# Altium project NODE_2.PrjPcb
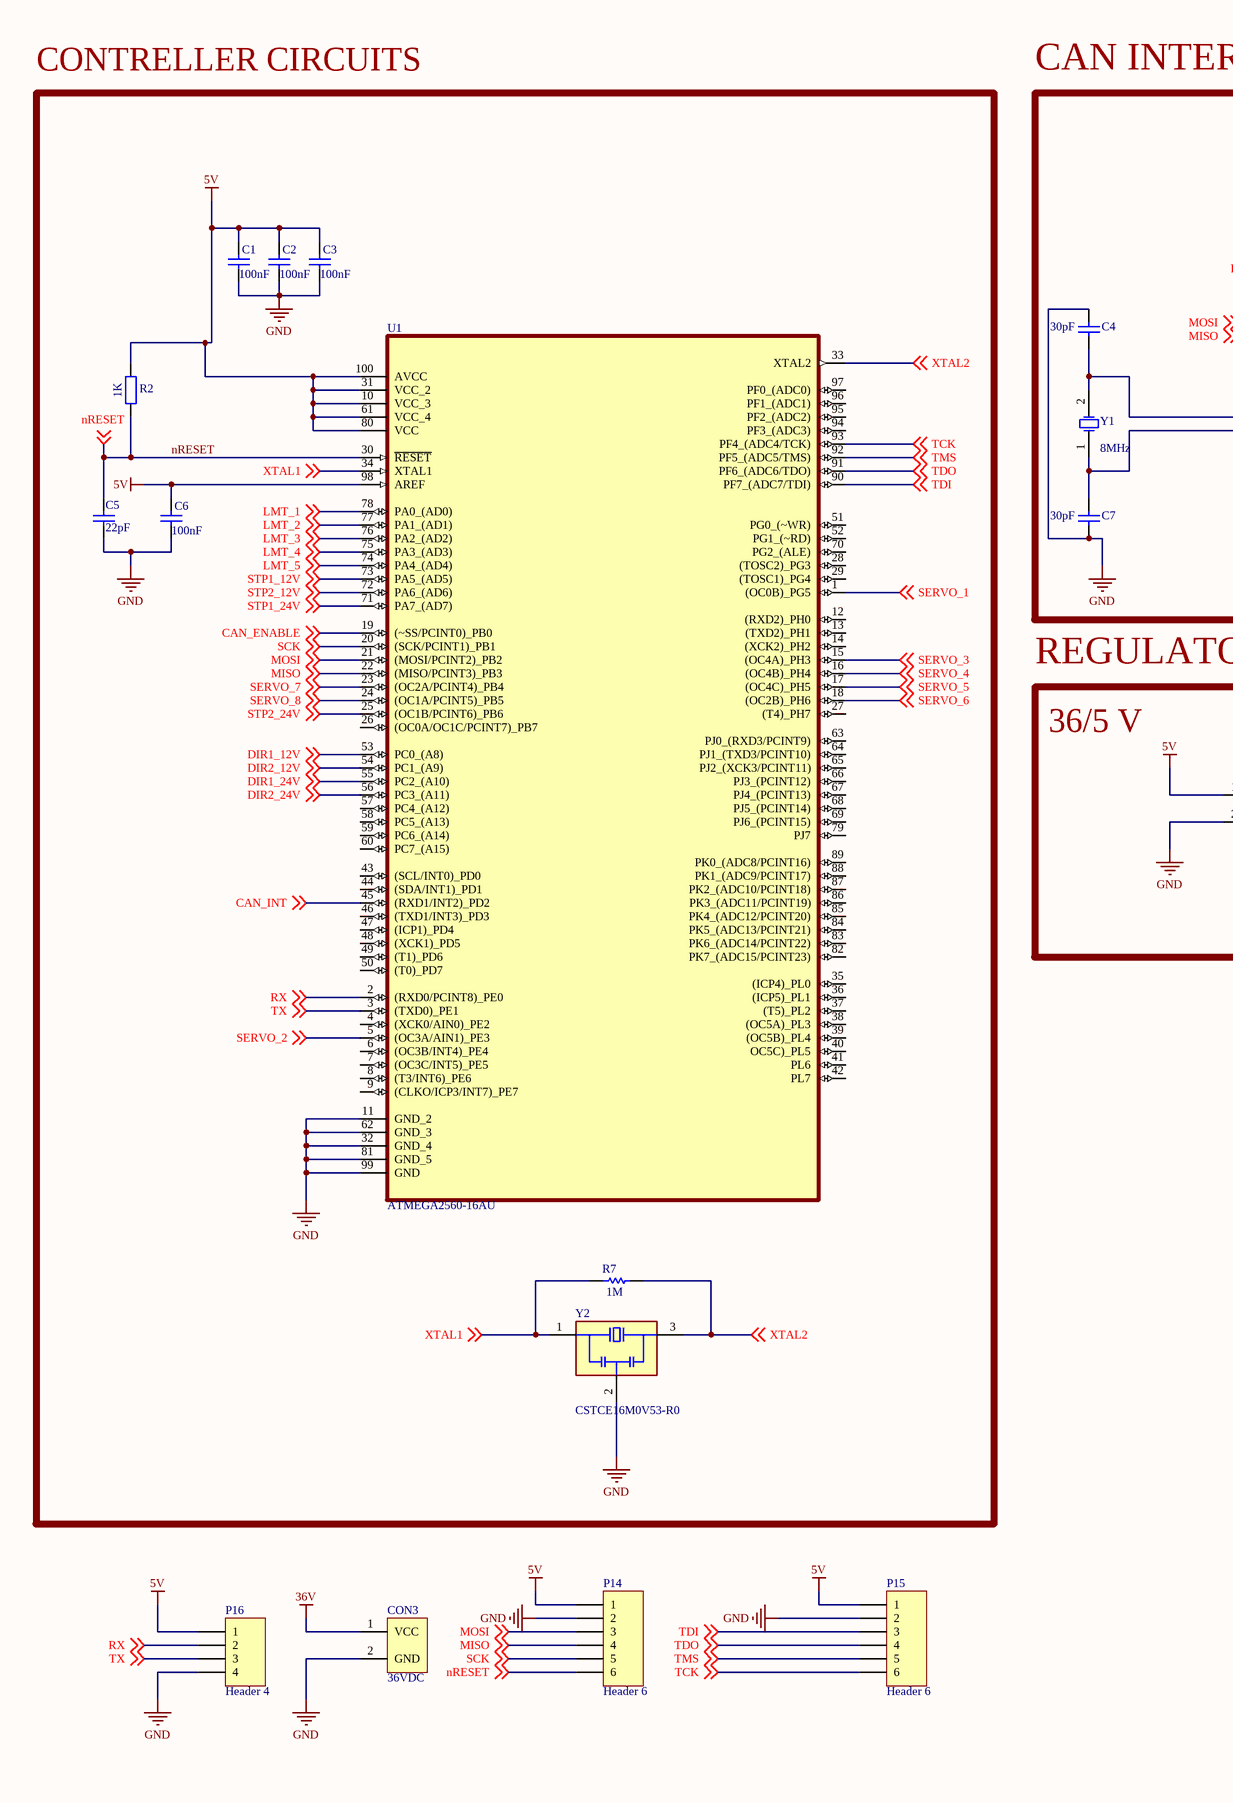
[diagram p0: NODE_2_SCH.SchDoc, left]
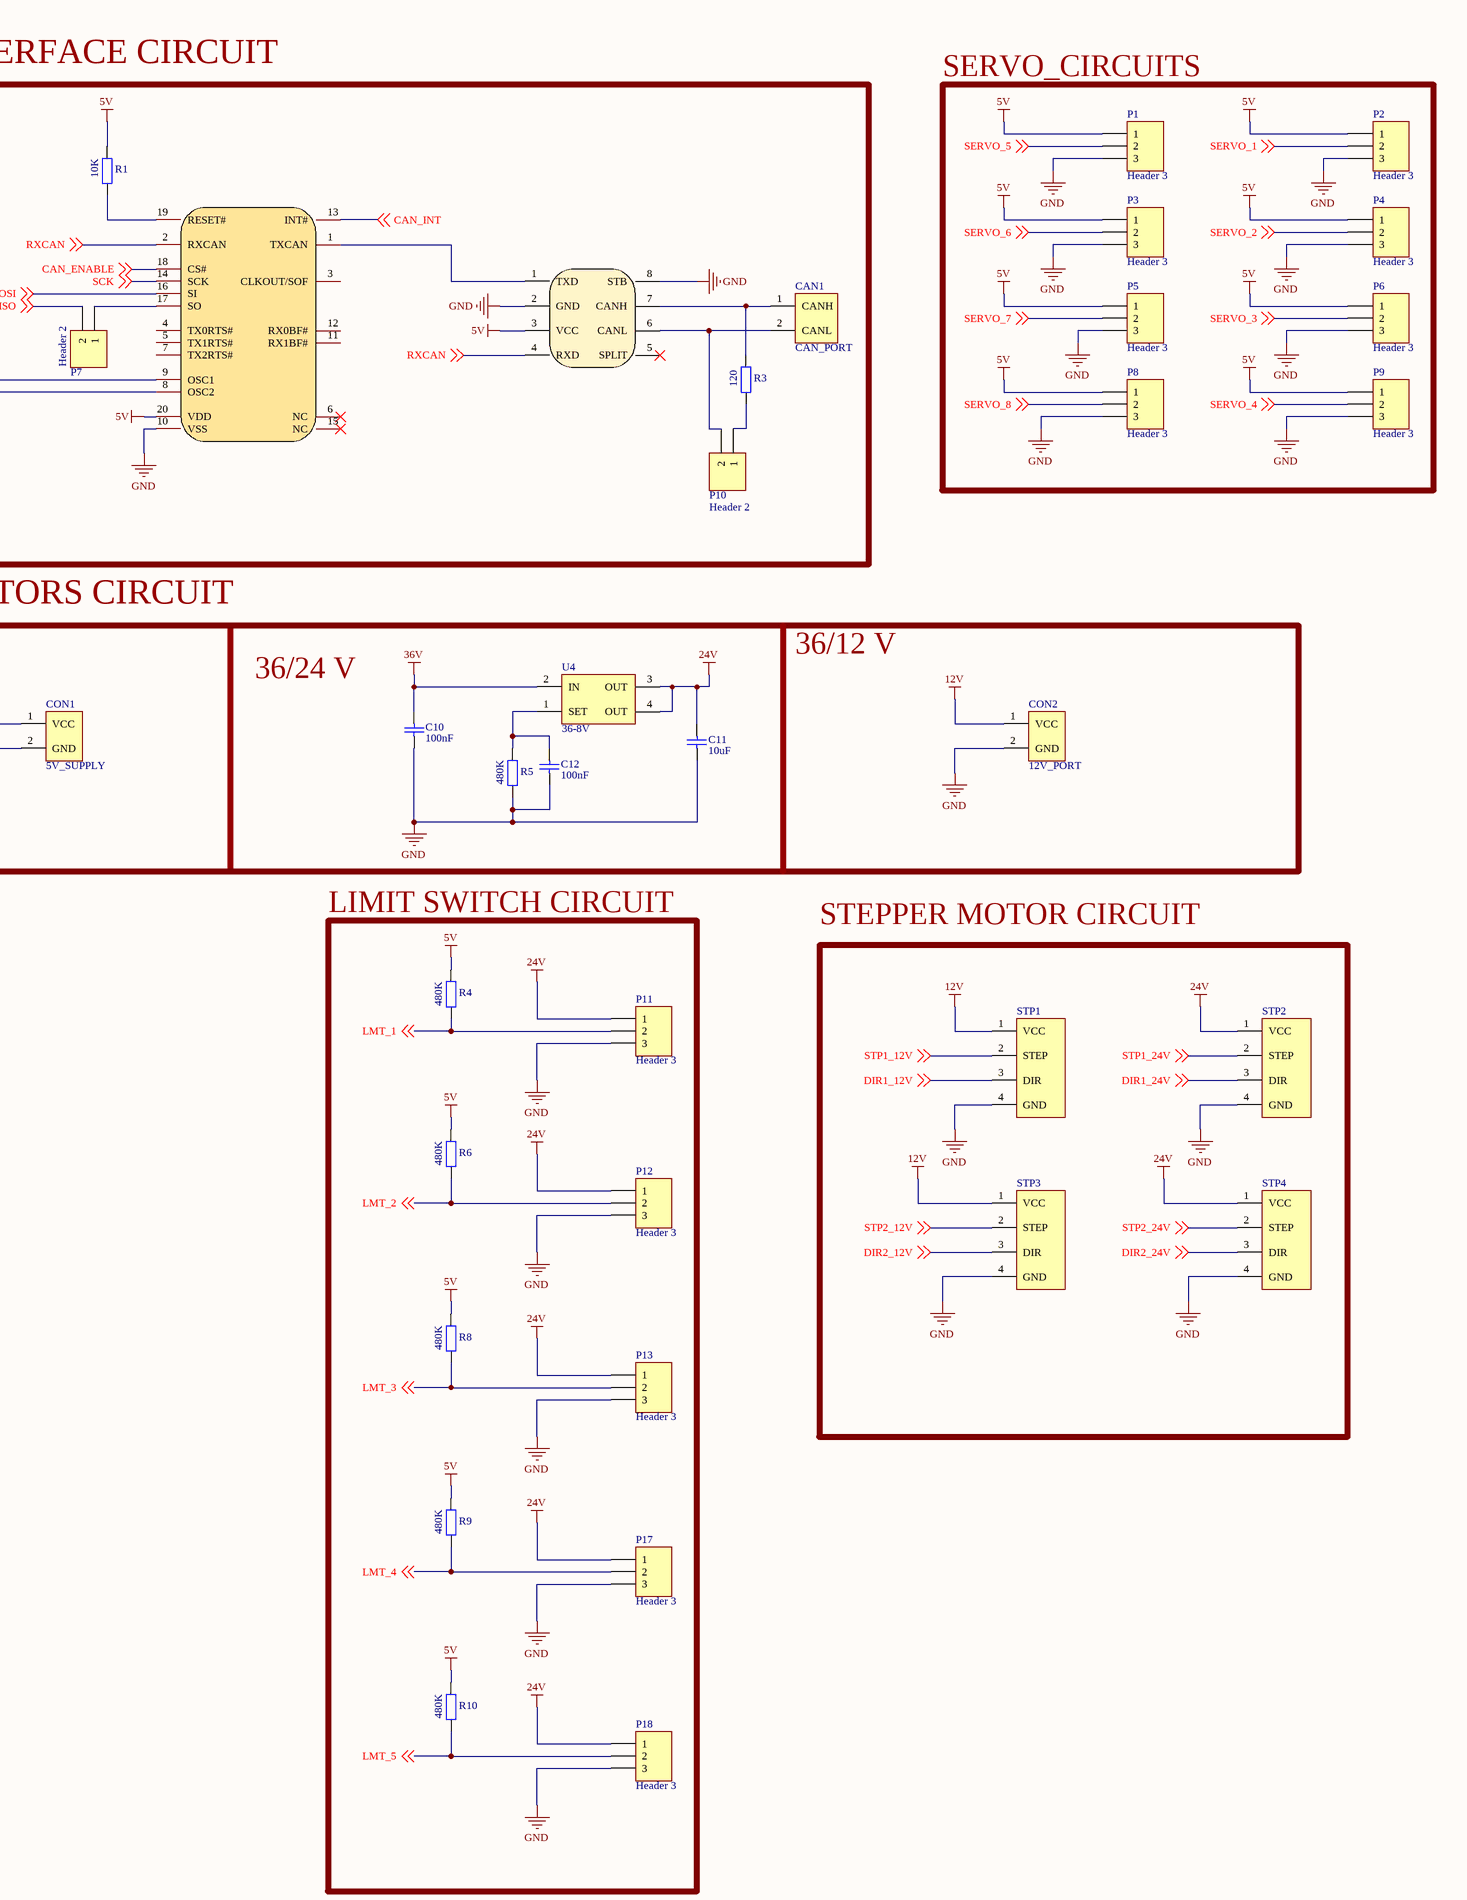
[diagram p1: NODE_2_SCH.SchDoc, right]
1 sheet, 52 parts. Net scope: global (net labels, ports and power ports of the same name join across sheets).
Board file: NODE_2_PCB.PcbDoc

## Sheet NODE_2_SCH.SchDoc
size A2; SheetNumber: 1; SheetTotal: 1; SPICEModelCacheEQZNOBOB: <root> / <DocumentId>EQZNOBOB</DocumentId> / <CacheFrame Number="0"> / <Model Name="xtal" Kind="CKT"> / <Text>*Generic type:crystal pkg:HC33/51 / .SUBCKT XTAL 1 2 PARAMS: FREQ=1Meg RS=750 C=13pf Q=1000 / LX 1 3 {((Q*RS)/(6.2831852*FREQ))} IC=0.5M / CX 3 4 {(1/(Q*6.2831852*FREQ*RS))} / C0 1 2 {C} / RS 4 2 {RS} / .ENDS XTAL</Text> / </Model> / </CacheFrame> / </root>

### Parts
C1  value 100nF  [CAPC2012X135N]  (hidden comment: Cap)
C2  value 100nF  [CAPC2012X135N]  (hidden comment: Cap)
C3  value 100nF  [CAPC2012X135N]  (hidden comment: Cap)
C4  value 30pF  [CAPC2012X135N]  (hidden comment: Cap)
C5  value 22pF  [CAPC2012X135N]  (hidden comment: Cap)
C6  value 100nF  [CAPC2012X135N]  (hidden comment: Cap)
C7  value 30pF  [CAPC2012X135N]  (hidden comment: Cap)
C10  value 100nF  [CAPC2012X135N]  (hidden comment: Cap)
C11  value 10uF  [CAPC2012X135N]  (hidden comment: Cap)
C12  value 100nF  [CAPC2012X135N]  (hidden comment: Cap)
CAN1  CAN_PORT  [12V_CON]
CON1  5V_SUPPLY  [12V_CON]
CON2  12V_PORT  [12V_CON]
CON3  36VDC  [12V_CON]
P1  Header 3  [3PIN_H]
P2  Header 3  [3PIN_H]
P3  Header 3  [3PIN_H]
P4  Header 3  [3PIN_H]
P5  Header 3  [3PIN_H]
P6  Header 3  [3PIN_H]
P7  Header 2  [SAMTEC_TS-102-G-A]
P8  Header 3  [3PIN_H]
P9  Header 3  [3PIN_H]
P10  Header 2  [SAMTEC_TS-102-G-A]
P11  Header 3  [3PIN_H]
P12  Header 3  [3PIN_H]
P13  Header 3  [3PIN_H]
P14  Header 6  [HDR1X6]
P15  Header 6  [HDR1X6]
P16  Header 4  [HDR1X4]
P17  Header 3  [3PIN_H]
P18  Header 3  [3PIN_H]
R1  value 10K  [RESC2013X06N]  (hidden comment: Res2)
R2  value 1K  [RESC2013X06N]  (hidden comment: Res2)
R3  value 120  [CRCW1206120RFKEAHP]  (hidden comment: Res2)
R4  value 480K  [CRCW1206120RFKEAHP]  (hidden comment: Res2)
R5  value 480K  [CRCW1206120RFKEAHP]  (hidden comment: Res2)
R6  value 480K  [CRCW1206120RFKEAHP]  (hidden comment: Res2)
R7  value 1M  [RESC2013X06N]  (hidden comment: Res1)
R8  value 480K  [CRCW1206120RFKEAHP]  (hidden comment: Res2)
R9  value 480K  [CRCW1206120RFKEAHP]  (hidden comment: Res2)
R10  value 480K  [CRCW1206120RFKEAHP]  (hidden comment: Res2)
STP1  STPR_MTR_PORT  [CONN-TH_4P-P5.08_DIBO_DB128V-5.08 - duplicate1]  (value not drawn)
STP2  STPR_MTR_PORT  [CONN-TH_4P-P5.08_DIBO_DB128V-5.08 - duplicate1]  (value not drawn)
STP3  STPR_MTR_PORT  [CONN-TH_4P-P5.08_DIBO_DB128V-5.08 - duplicate1]  (value not drawn)
STP4  STPR_MTR_PORT  [CONN-TH_4P-P5.08_DIBO_DB128V-5.08 - duplicate1]  (value not drawn)
U1  ATMEGA2560-16AU  [QFP50P1600X1600X120-100N]
U2  TJA1050DRG  [SOP-8_L4.9-W3.9-P1.27-LS6.0-BL - duplicate]  (value not drawn)
U3  MCP2515T-I/ST  [TSSOP-20_L6.5-W4.4-P0.65-LS6.4-BL]  (value not drawn)
U4  36-8V  [SOT-223-3_L6.5-W3.4-P2.30-LS7.0-BR]
Y1  value 8MHz  [CRYSTAL-SMD_L7.4-W4.0-LS8.0]  (hidden comment: XTAL)
Y2  CSTCE16M0V53-R0  [OSC_CSTCE16M0V53-R0]

### Blocks framed on the sheet
CONTRELLER CIRCUITS: C1-C3 C5 C6 R2 R7 U1 Y2
CAN INTERFACE CIRCUIT: C4 C7 CAN1 P7 P10 R1 R3 U2 U3 Y1
SERVO_CIRCUITS: P1-P6 P8 P9
REGULATORS CIRCUIT: C10-C12 CON1 CON2 R5 U4
LIMIT SWITCH CIRCUIT: P11-P13 P17 P18 R4 R6 R8-R10
STEPPER MOTOR CIRCUIT: STP1-STP4

### Nets
5V: C1.1 C2.1 C3.1 C6.1 CON1.1(VCC) P1.1 P2.1 P3.1 P4.1 P5.1 P6.1 P8.1 P9.1 P14.1 P15.1 P16.1 R1.2 R2.2 R4.2 R6.2 R8.2 R9.2 R10.2 U1.10(VCC_3) U1.31(VCC_2) U1.61(VCC_4) U1.80(VCC) U1.98(AREF) U1.100(AVCC) U2.3(VCC) U3.20(VDD)
12V: CON2.1(VCC) STP1.1(VCC) STP3.1(VCC)
24V: C11.2 P11.1 P12.1 P13.1 P17.1 P18.1 STP2.1(VCC) STP4.1(VCC) U4.3(OUT) U4.4(OUT)
36V: C10.2 CON3.1(VCC) U4.2(IN)
GND: C1.2 C2.2 C3.2 C4.1 C5.2 C6.2 C7.2 C10.1 C11.1 C12.1 CON1.2(GND) CON2.2(GND) CON3.2(GND) P1.3 P2.3 P3.3 P4.3 P5.3 P6.3 P8.3 P9.3 P11.3 P12.3 P13.3 P14.2 P15.2 P16.4 P17.3 P18.3 R5.1 STP1.4(GND) STP2.4(GND) STP3.4(GND) STP4.4(GND) U1.11(GND_2) U1.32(GND_4) U1.62(GND_3) U1.81(GND_5) U1.99(GND) U2.2(GND) U2.8(STB) U3.10(VSS) Y2.2(GND)
CAN_ENABLE: U1.19((~SS/PCINT0)_PB0) U3.18(CS#) ; off-sheet CAN_ENABLE
CAN_INT: U1.45((RXD1/INT2)_PD2) U3.13(INT#) ; off-sheet CAN_INT
DIR1_12V: STP1.3(DIR) U1.53(PC0_(A8)) ; off-sheet DIR1_12V
DIR1_24V: STP2.3(DIR) U1.55(PC2_(A10)) ; off-sheet DIR1_24V
DIR2_12V: STP3.3(DIR) U1.54(PC1_(A9)) ; off-sheet DIR2_12V
DIR2_24V: STP4.3(DIR) U1.56(PC3_(A11)) ; off-sheet DIR2_24V
LMT_1: P11.2 R4.1 U1.78(PA0_(AD0)) ; off-sheet LMT_1
LMT_2: P12.2 R6.1 U1.77(PA1_(AD1)) ; off-sheet LMT_2
LMT_3: P13.2 R8.1 U1.76(PA2_(AD2)) ; off-sheet LMT_3
LMT_4: P17.2 R9.1 U1.75(PA3_(AD3)) ; off-sheet LMT_4
LMT_5: P18.2 R10.1 U1.74(PA4_(AD4)) ; off-sheet LMT_5
MISO: P7.2 P14.4 U1.22((MISO/PCINT3)_PB3) ; off-sheet MISO
MOSI: P14.3 U1.21((MOSI/PCINT2)_PB2) U3.16(SI) ; off-sheet MOSI
nRESET: C5.1 P14.6 R2.1 U1.30(~{RESET}) ; off-sheet nRESET
RX: P16.2 U1.2((RXD0/PCINT8)_PE0) ; off-sheet RX
RXCAN: U2.4(RXD) U3.2(RXCAN) ; off-sheet RXCAN
SCK: P14.5 U1.20((SCK/PCINT1)_PB1) U3.14(SCK) ; off-sheet SCK
SERVO_1: P2.2 U1.1((OC0B)_PG5) ; off-sheet SERVO_1
SERVO_2: P4.2 U1.5((OC3A/AIN1)_PE3) ; off-sheet SERVO_2
SERVO_3: P6.2 U1.15((OC4A)_PH3) ; off-sheet SERVO_3
SERVO_4: P9.2 U1.16((OC4B)_PH4) ; off-sheet SERVO_4
SERVO_5: P1.2 U1.17((OC4C)_PH5) ; off-sheet SERVO_5
SERVO_6: P3.2 U1.18((OC2B)_PH6) ; off-sheet SERVO_6
SERVO_7: P5.2 U1.23((OC2A/PCINT4)_PB4) ; off-sheet SERVO_7
SERVO_8: P8.2 U1.24((OC1A/PCINT5)_PB5) ; off-sheet SERVO_8
STP1_12V: STP1.2(STEP) U1.73(PA5_(AD5)) ; off-sheet STP1_12V
STP1_24V: STP2.2(STEP) U1.71(PA7_(AD7)) ; off-sheet STP1_24V
STP2_12V: STP3.2(STEP) U1.72(PA6_(AD6)) ; off-sheet STP2_12V
STP2_24V: STP4.2(STEP) U1.25((OC1B/PCINT6)_PB6) ; off-sheet STP2_24V
TCK: P15.6 U1.93(PF4_(ADC4/TCK)) ; off-sheet TCK
TDI: P15.3 U1.90(PF7_(ADC7/TDI)) ; off-sheet TDI
TDO: P15.4 U1.91(PF6_(ADC6/TDO)) ; off-sheet TDO
TMS: P15.5 U1.92(PF5_(ADC5/TMS)) ; off-sheet TMS
TX: P16.3 U1.3((TXD0)_PE1) ; off-sheet TX
XTAL1: R7.1 U1.34(XTAL1) Y2.1(IN) ; off-sheet XTAL1
XTAL2: R7.2 U1.33(XTAL2) Y2.3(OUT) ; off-sheet XTAL2
NetC4_2: C4.2 U3.9(OSC1) Y1.2(OSC2)
NetC7_1: C7.1 U3.8(OSC2) Y1.1(OSC1)
NetC12_2: C12.2 R5.2 U4.1(SET)
NetCAN1_1: CAN1.1(CANH) R3.2 U2.7(CANH)
NetCAN1_2: CAN1.2(CANL) P10.2 U2.6(CANL)
NetP7_1: P7.1 U3.17(SO)
NetP10_1: P10.1 R3.1
NetR1_1: R1.1 U3.19(RESET#)
NetU2_1: U2.1(TXD) U3.1(TXCAN)

Not connected (* = marked no-connect by the designer): U1 4((XCK0/AIN0)_PE2) 6((OC3B/INT4)_PE4) 7((OC3C/INT5)_PE5) 8((T3/INT6)_PE6) 9((CLKO/ICP3/INT7)_PE7) 12((RXD2)_PH0) 13((TXD2)_PH1) 14((XCK2)_PH2) 26((OC0A/OC1C/PCINT7)_PB7) 27((T4)_PH7) 28((TOSC2)_PG3) 29((TOSC1)_PG4) 35((ICP4)_PL0) 36((ICP5)_PL1) 37((T5)_PL2) 38((OC5A)_PL3) 39((OC5B)_PL4) 40(OC5C)_PL5) 41(PL6) 42(PL7) 43((SCL/INT0)_PD0) 44((SDA/INT1)_PD1) 46((TXD1/INT3)_PD3) 47((ICP1)_PD4) 48((XCK1)_PD5) 49((T1)_PD6) 50((T0)_PD7) 51(PG0_(~WR)) 52(PG1_(~RD)) 57(PC4_(A12)) 58(PC5_(A13)) 59(PC6_(A14)) 60(PC7_(A15)) 63(PJ0_(RXD3/PCINT9)) 64(PJ1_(TXD3/PCINT10)) 65(PJ2_(XCK3/PCINT11)) 66(PJ3_(PCINT12)) 67(PJ4_(PCINT13)) 68(PJ5_(PCINT14)) 69(PJ6_(PCINT15)) 70(PG2_(ALE)) 79(PJ7) 82(PK7_(ADC15/PCINT23)) 83(PK6_(ADC14/PCINT22)) 84(PK5_(ADC13/PCINT21)) 85(PK4_(ADC12/PCINT20)) 86(PK3_(ADC11/PCINT19)) 87(PK2_(ADC10/PCINT18)) 88(PK1_(ADC9/PCINT17)) 89(PK0_(ADC8/PCINT16)) 94(PF3_(ADC3)) 95(PF2_(ADC2)) 96(PF1_(ADC1)) 97(PF0_(ADC0)); U2 5(SPLIT)*; U3 3(CLKOUT/SOF) 4(TX0RTS#) 5(TX1RTS#) 6(NC)* 7(TX2RTS#) 11(RX1BF#) 12(RX0BF#) 15(NC)*

### Notes on the sheet
- 36/12 V
- 36/5 V
- 36/24 V

### Library data of the parts
C1-C3 C6 C10 C12 = Cap: Capacitor; Part Number: TCC0805X7R104M500DT; Published: 8-Jun-2000; LatestRevisionDate: 17-Jul-2002; LatestRevisionNote: Re-released for DXP Platform.; PackageReference: RAD-0.3; Publisher: Altium Limited; PackageDescription: Radial Cap, Thru-Hole; 2 Leads; 0.3 in Pin Spacing
  C10 C12: PN: TCC0805X7R104M500DT
C4 C7 = Cap: Capacitor; Part Number: TCC0805COG300J500BT; Published: 8-Jun-2000; LatestRevisionDate: 17-Jul-2002; LatestRevisionNote: Re-released for DXP Platform.; PackageReference: RAD-0.3; Publisher: Altium Limited; PackageDescription: Radial Cap, Thru-Hole; 2 Leads; 0.3 in Pin Spacing
C5 = Cap: Capacitor; Part Number: TCC0805COG220J500BT; Published: 8-Jun-2000; LatestRevisionDate: 17-Jul-2002; LatestRevisionNote: Re-released for DXP Platform.; PackageReference: RAD-0.3; Publisher: Altium Limited; PackageDescription: Radial Cap, Thru-Hole; 2 Leads; 0.3 in Pin Spacing
C11 = Cap: Capacitor; Part Number: CL21A106KOQNNNE; Published: 8-Jun-2000; LatestRevisionDate: 17-Jul-2002; LatestRevisionNote: Re-released for DXP Platform.; PackageReference: RAD-0.3; Publisher: Altium Limited; PackageDescription: Radial Cap, Thru-Hole; 2 Leads; 0.3 in Pin Spacing
CAN1 = 2PIN_CON_1: Part Number: MX126-5.0-02P-GN01-Cu-S-A
CON1 CON2 = 2PIN_CON: Part Number: MX126-5.0-02P-GN01-Cu-S-A
CON3 = 2PIN_CON_2: Part Number: MX126-5.0-02P-GN01-Cu-S-A
P1-P6 P8 P9 P11-P13 P17 P18 = Header 3: Header, 3-Pin; Part Number: DB125-3.81-3P-BK-S; LatestRevisionDate: 17-Jul-2002; LatestRevisionNote: Re-released for DXP Platform.; Publisher: Altium Limited
P7 P10 = Header 2: Header, 2-Pin; Part Number: PH-01078; LatestRevisionDate: 17-Jul-2002; LatestRevisionNote: Re-released for DXP Platform.; Publisher: Altium Limited
P14 P15 = Header 6: Header, 6-Pin; Part Number: P125-1106A0BS116A1; LatestRevisionDate: 17-Jul-2002; LatestRevisionNote: Re-released for DXP Platform.; Publisher: Altium Limited
P16 = Header 4: Header, 4-Pin; Part Number: HB-PH3-25414PB2GOP; LatestRevisionDate: 17-Jul-2002; LatestRevisionNote: Re-released for DXP Platform.; Publisher: Altium Limited
R1 = Res2: Resistor; Part Number: RC0805JR-0710KL; Published: 8-Jun-2000; LatestRevisionDate: 17-Jul-2002; LatestRevisionNote: Re-released for DXP Platform.; PackageReference: AXIAL-0.4; Publisher: Altium Limited; PackageDescription: Axial Device, Thru-Hole; 2 Leads; 0.4 in Pin Spacing
R2 = Res2: Resistor; Part Number: RC0805JR-071KL; Published: 8-Jun-2000; LatestRevisionDate: 17-Jul-2002; LatestRevisionNote: Re-released for DXP Platform.; PackageReference: AXIAL-0.4; Publisher: Altium Limited; PackageDescription: Axial Device, Thru-Hole; 2 Leads; 0.4 in Pin Spacing
R3 = Res2: Resistor; Published: 8-Jun-2000; LatestRevisionDate: 17-Jul-2002; LatestRevisionNote: Re-released for DXP Platform.; PackageReference: AXIAL-0.4; Publisher: Altium Limited; PackageDescription: Axial Device, Thru-Hole; 2 Leads; 0.4 in Pin Spacing; Part Number: CRCW1206120RFKEAHP
R4-R6 R8-R10 = Res2: Resistor; Part Number: 1206W4J0484T5E; Published: 8-Jun-2000; LatestRevisionDate: 17-Jul-2002; LatestRevisionNote: Re-released for DXP Platform.; PackageReference: AXIAL-0.4; Publisher: Altium Limited; PackageDescription: Axial Device, Thru-Hole; 2 Leads; 0.4 in Pin Spacing
R7 = Res1: Resistor; Part Number: RC0805JR-071KL; Published: 8-Jun-2000; LatestRevisionDate: 17-Jul-2002; LatestRevisionNote: Re-released for DXP Platform.; PackageReference: AXIAL-0.3; Publisher: Altium Limited; PackageDescription: Axial Device, Thru-Hole; 2 Leads; 0.3 in Pin Spacing
STP1-STP4 = STPR_MTR_PORT: OUTPUT TO SUPPLY THE STEPPER MOTOR NEEDS; Part Number: WJ500V-5.08-2P
U1 = ATMEGA2560-16AU: AVR AVRÂ® ATmega Microcontroller IC 8-Bit 16MHz 256KB (128K x 16) FLASH 100-TQFP (14x14); MF: Microchip; Package: TQFP-100 Microchip; Price: None; Check_prices: https://www.snapeda.com/parts/ATMEGA2560-16AU/Microchip/view-part/?ref=eda; Value: *; SnapEDA_Link: https://www.snapeda.com/parts/ATMEGA2560-16AU/Microchip/view-part/?ref=snap; Part Number: ATMEGA2560-16AU; Availability: In Stock; Purchase-URL: https://pricing.snapeda.com/search?q=ATMEGA2560-16AU&ref=eda
U2 = TJA1050DRG: Manufacturer: HGC(深圳汉芯); Add into BOM: yes; Symbol: TJA1050DRG; Device: TJA1050DRG; LCSC Part Name: TJA1050DRG; Supplier Part: C19723770; Part Number: TJA1050DRG; Supplier Footprint: SOP-8; JLCPCB Part Class: Extended Part; Datasheet: https://atta.szlcsc.com/upload/public/pdf/source/20231229/9EC40A6172CAB0350BF7AF3421F4DEBF.pdf; Supplier: LCSC; Convert to PCB: yes
U3 = MCP2515T-I/ST: Manufacturer: MICROCHIP(美国微芯); Add into BOM: yes; Supply Voltage: 2.7V~5.5V; Supply Current: 10mA; Symbol: MCP2515T-I/ST; Device: MCP2515T-I/ST; LCSC Part Name: 2.7V~5.5V; Supplier Part: C185941; Part Number: MCP2515T-I/ST; Supplier Footprint: TSSOP-20; JLCPCB Part Class: Extended Part; Datasheet: https://atta.szlcsc.com/upload/public/pdf/source/20180521/C185941_CF4E8B602AE128DB1B8E6B0AB1F829A7.pdf; Supplier: LCSC; Convert to PCB: yes; Operating Temperature: -40℃~+85℃
U4 = LT3088MPST#PBF: LDO Regulator Pos 0V to 34.5V 0.8A Automotive 4-Pin(3+Tab) SOT-223 Tube; Manufacturer: Analog Devices / Linear Technology; Supplier: Mouser; Supplier Part Number: 584-LT3088MPST#PBF; Part Number: LT3088MPST#PBF; RoHS: Yes; Category: Voltage Regulators - Linear; Stock: 477; Pricing: 1=13.29, 10=12.21, 50=11.71, 100=10.32, 1000=9.18, 10000=9.18 (USD); ComponentLink1URL: http://www.linear.com/docs/46566?src-supplier=Digikey; ComponentLink1Description: http://www.linear.com/docs/46566?src-supplier=Digikey
Y1 = XTAL: Crystal Oscillator; Part Number: S47SMD8.000M12PF20R30B3; Published: 8-Jun-2000; LatestRevisionDate: 17-Jul-2002; LatestRevisionNote: Re-released for DXP Platform.; PackageReference: R38; Publisher: Altium Limited; PackageDescription: Crystal, Thru-Hole; 2 Leads; Body 3.1 x 8.2 mm (Dia.xH)
Y2 = CSTCE16M0V53-R0: 16 MHz Ceramic Resonator Built in Capacitor 15 pF Â±0.3% -20Â°C ~ 80Â°C Surface Mount; MF: Murata; Value: 16MHz; Price: None; Package: SMD-3 Murata; Purchase-URL: https://pricing.snapeda.com/search/part/CSTCE16M0V53-R0/?ref=eda; Availability: In Stock; SnapEDA_Link: https://www.snapeda.com/parts/CSTCE16M0V53-R0/Murata+Electronics+North+America/view-part/?ref=snap; Part Number: CSTCE16M0V53-R0; Check_prices: https://www.snapeda.com/parts/CSTCE16M0V53-R0/Murata+Electronics+North+America/view-part/?ref=eda